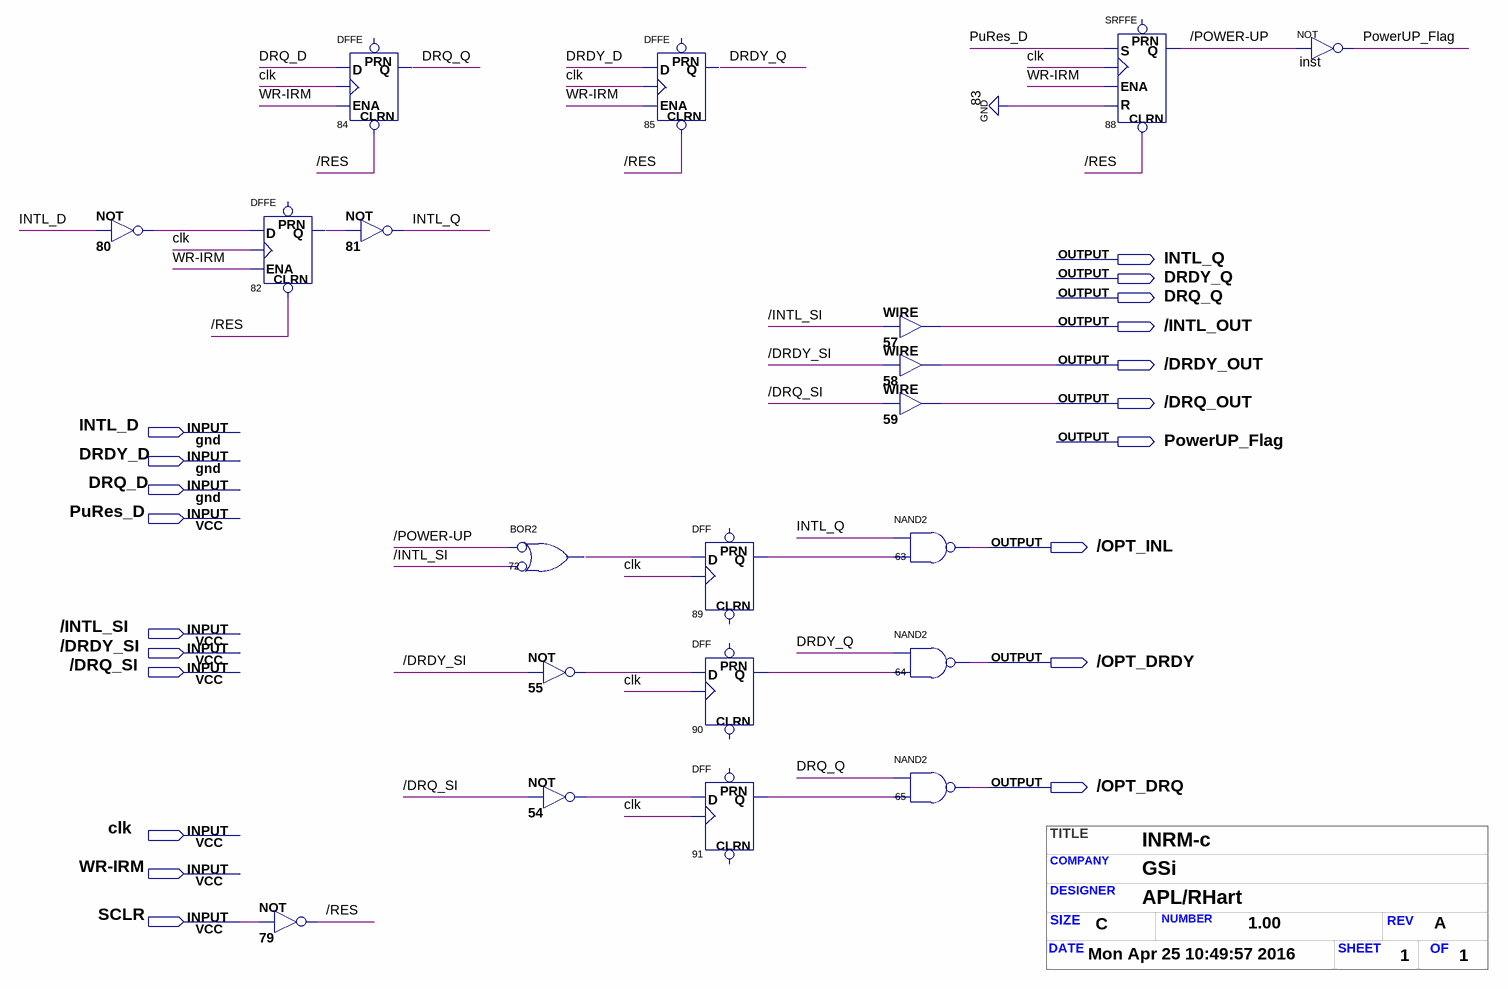
[diagram p0: schematic sheet]
// Quartus schematic inrm-c.bdf as structural Verilog: 20 symbols, 20 pins
// Title block: TITLE: INRM-c; COMPANY: GSi; DESIGNER: APL/RHart; SIZE: C; NUMBER: 1.00; REV: A; DATE: Mon Apr 25 10:49:57 2016; SHEET: 1; OF: 1
module \inrm-c  (
  input  INTL_D,
  input  DRDY_D,
  input  DRQ_D,
  input  PuRes_D,
  input  \/INTL_SI ,
  input  \/DRDY_SI ,
  input  \/DRQ_SI ,
  input  clk,
  input  \WR-IRM ,
  input  SCLR,
  output INTL_Q,
  output DRDY_Q,
  output DRQ_Q,
  output \/INTL_OUT ,
  output \/DRDY_OUT ,
  output \/DRQ_OUT ,
  output PowerUP_Flag,
  output \/OPT_INL ,
  output \/OPT_DRDY ,
  output \/OPT_DRQ 
);

  wire \/POWER-UP , \/RES , n54_out, n55_out, n72_out, n80_out, n82_q, n89_q, n90_q, n91_q;

  not u_80 (n80_out, INTL_D);
  DFFE u_82 (.CLRN(\/RES ), .D(n80_out), .CLK(clk), .ENA(\WR-IRM ), .Q(n82_q));  // open: PRN
  not u_79 (\/RES , SCLR);
  DFFE u_84 (.CLRN(\/RES ), .D(DRQ_D), .CLK(clk), .ENA(\WR-IRM ), .Q(DRQ_Q));  // open: PRN
  not u_81 (INTL_Q, n82_q);
  or u_72 (n72_out, ~\/POWER-UP , ~\/INTL_SI );  // BOR2
  not u_55 (n55_out, \/DRDY_SI );
  not u_54 (n54_out, \/DRQ_SI );
  DFFE u_85 (.CLRN(\/RES ), .D(DRDY_D), .CLK(clk), .ENA(\WR-IRM ), .Q(DRDY_Q));  // open: PRN
  DFF u_89 (.CLK(clk), .D(n72_out), .Q(n89_q));  // open: CLRN, PRN
  DFF u_90 (.CLK(clk), .D(n55_out), .Q(n90_q));  // open: CLRN, PRN
  DFF u_91 (.CLK(clk), .D(n54_out), .Q(n91_q));  // open: CLRN, PRN
  assign \/INTL_OUT  = \/INTL_SI ;  // WIRE 57
  assign \/DRDY_OUT  = \/DRDY_SI ;  // WIRE 58
  assign \/DRQ_OUT  = \/DRQ_SI ;  // WIRE 59
  nand u_63 (\/OPT_INL , INTL_Q, n89_q);
  nand u_64 (\/OPT_DRDY , DRDY_Q, n90_q);
  nand u_65 (\/OPT_DRQ , DRQ_Q, n91_q);
  SRFFE u_88 (.S(PuRes_D), .CLK(clk), .CLRN(\/RES ), .R(1'b0), .ENA(\WR-IRM ), .Q(\/POWER-UP ));  // open: PRN
  not inst (PowerUP_Flag, \/POWER-UP );
endmodule
